# Altium schematic sheet HMC2003_module_SET_RESET.SchDoc
size A2
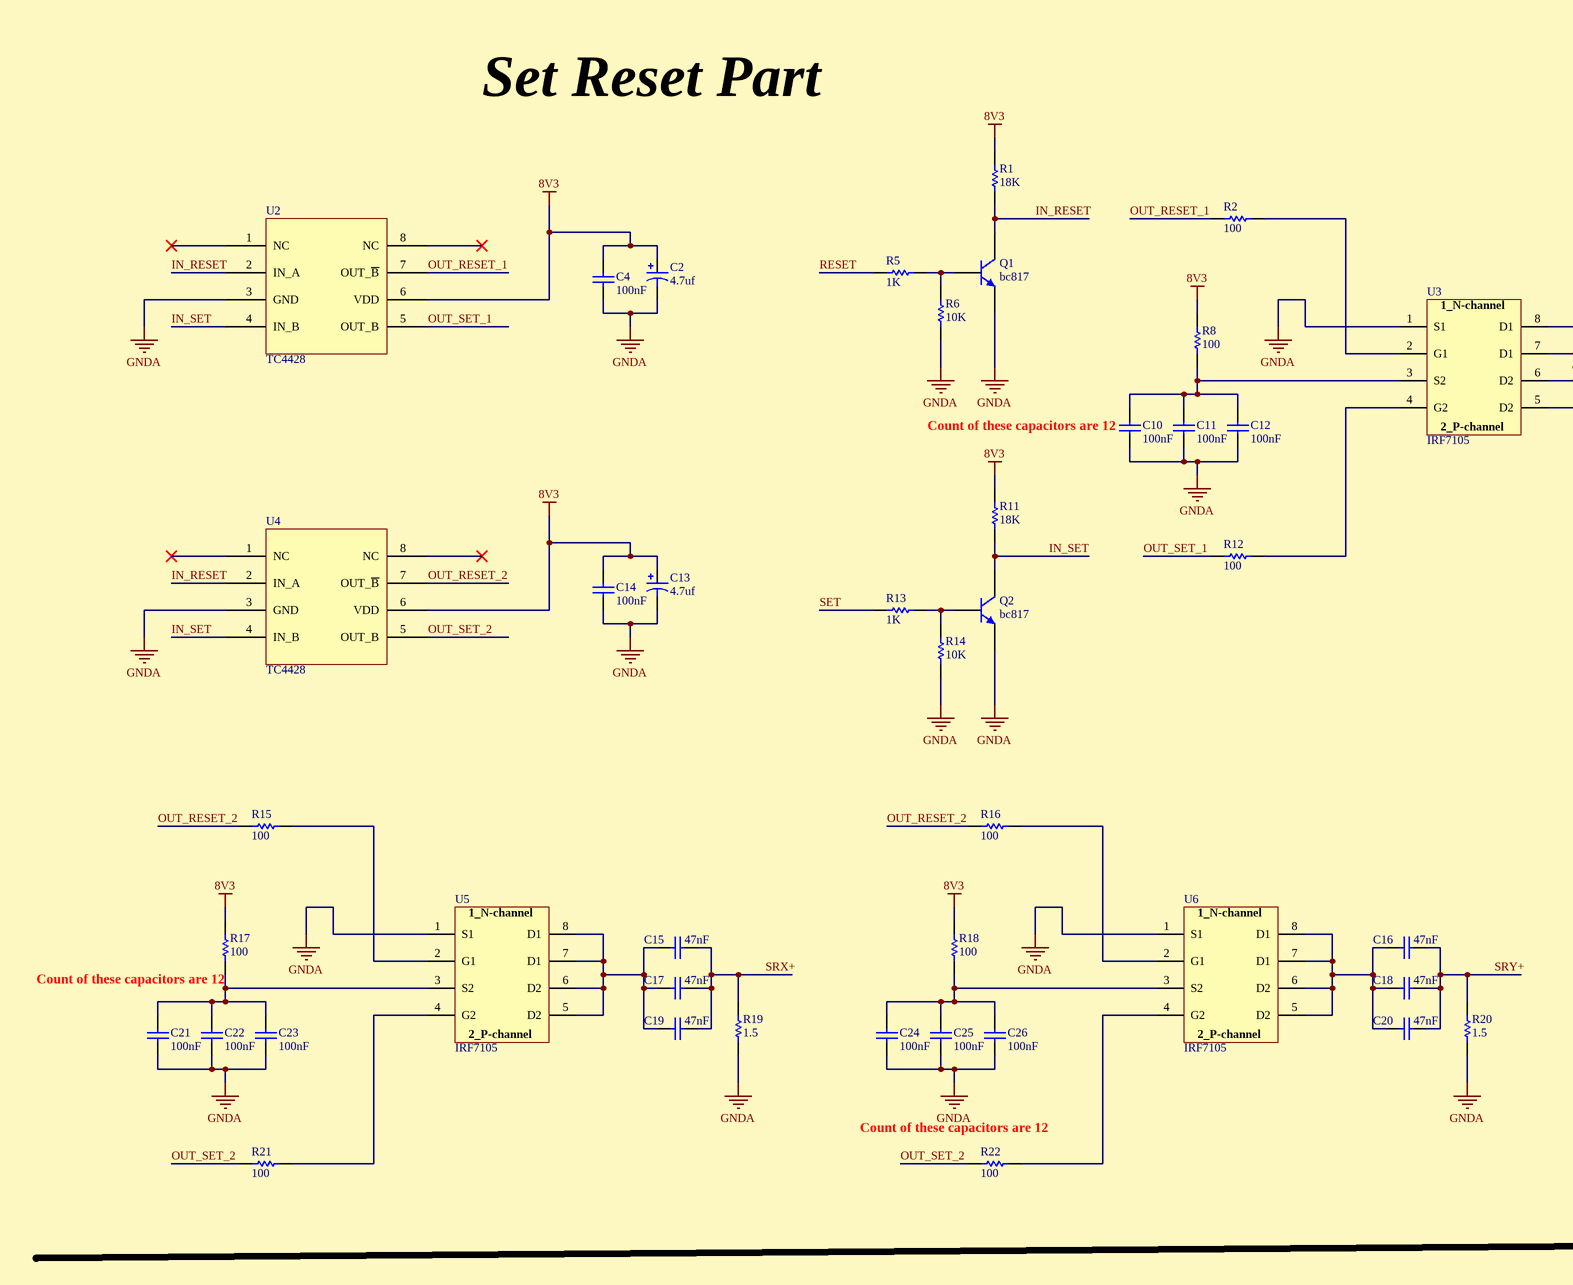
[diagram p0: HMC2003_module_SET_RESET.SchDoc, left]
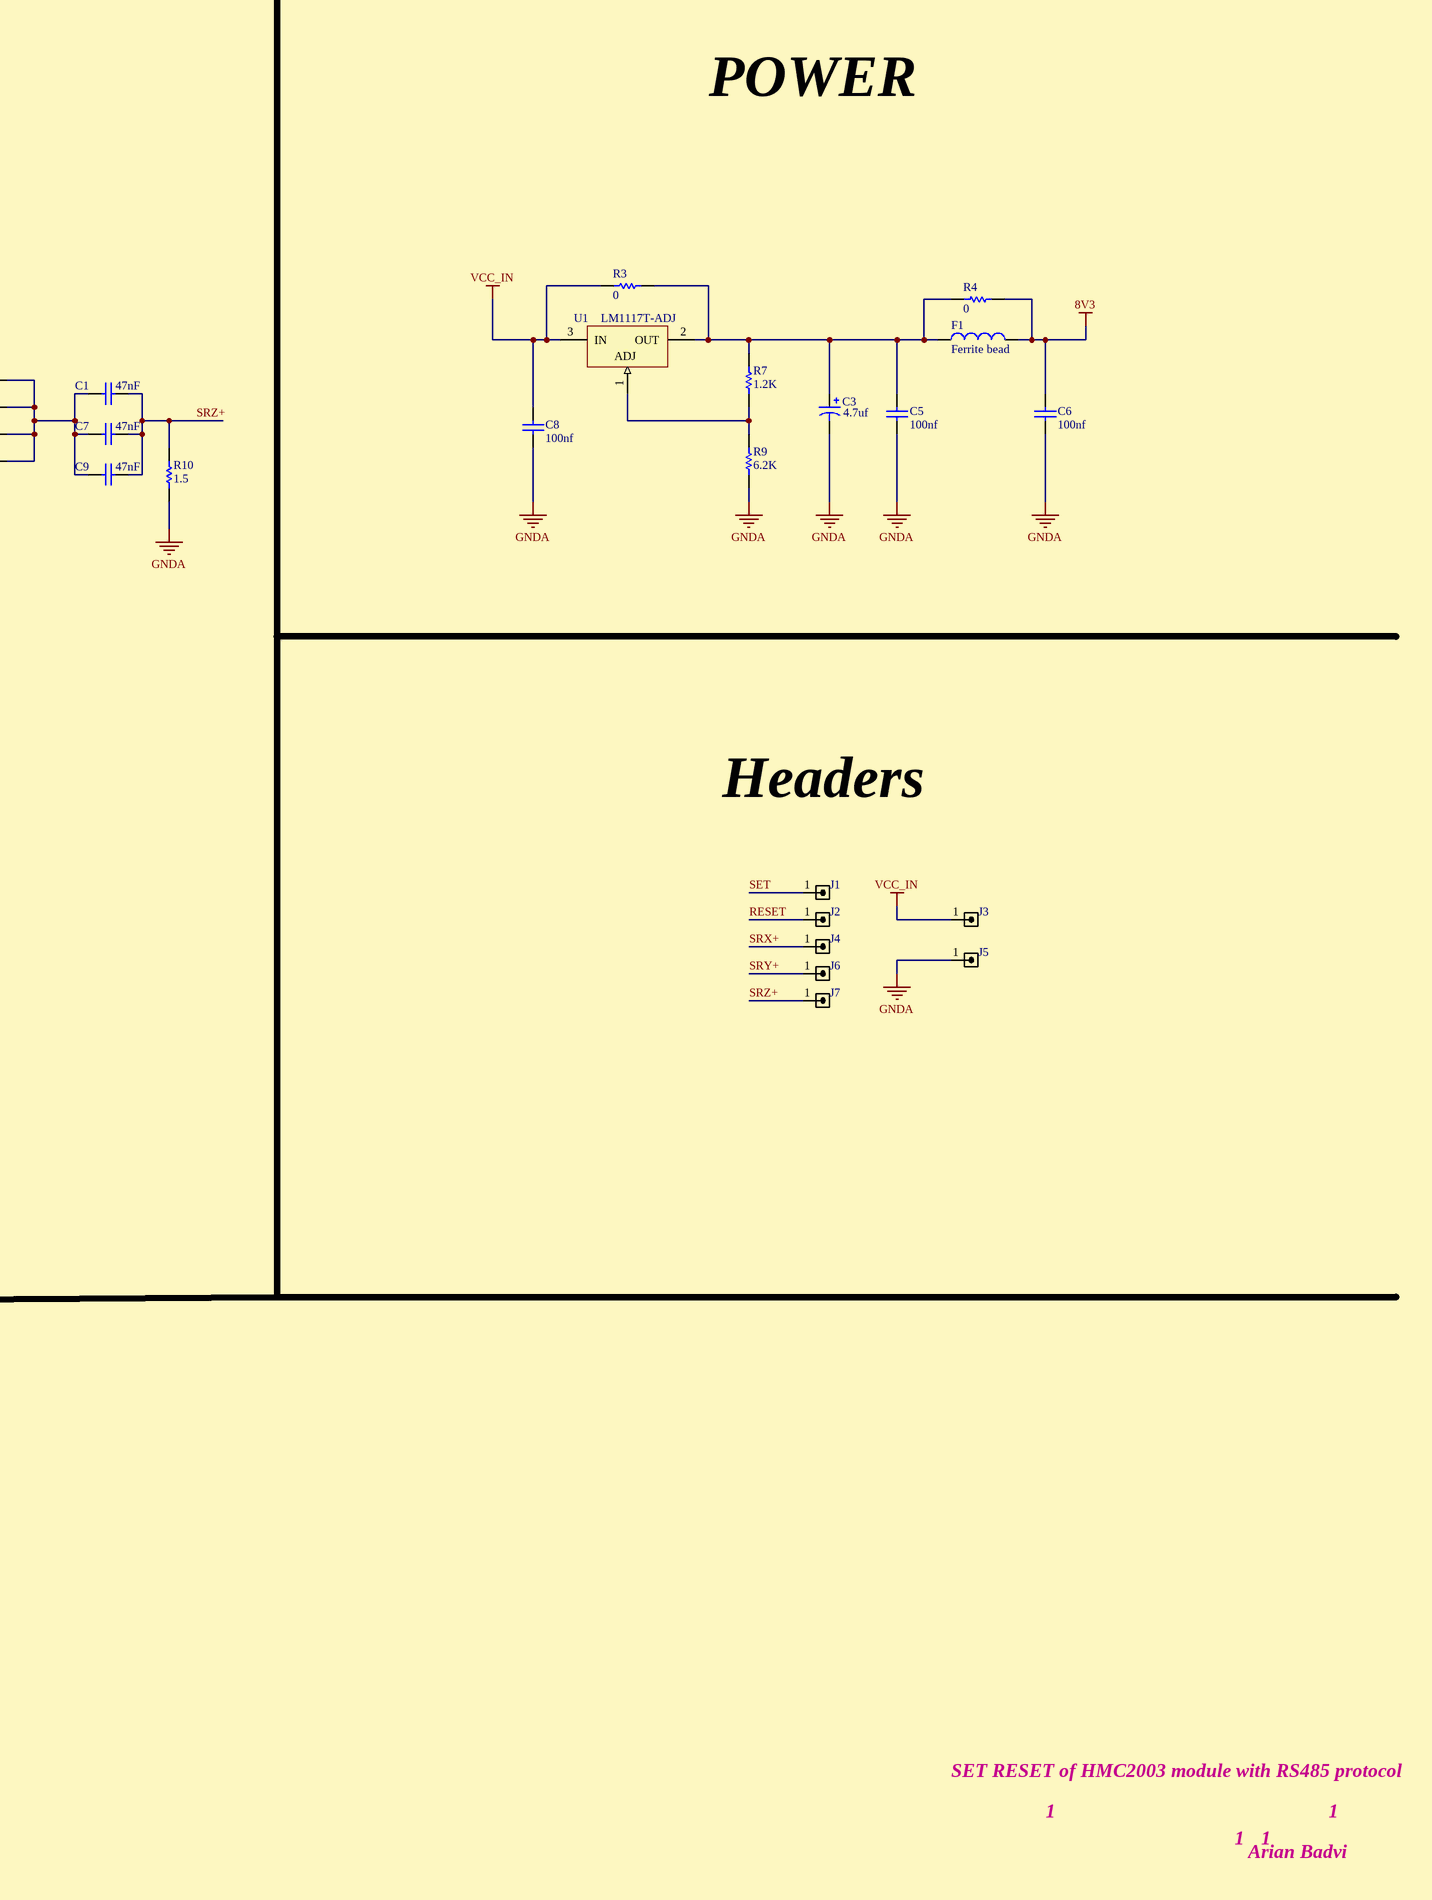
[diagram p1: HMC2003_module_SET_RESET.SchDoc, right]

## Parts
C1  47nF  [C1206]
C2  4.7uf  [cap_smd_a]
C3  4.7uf  [cap_smd_a]
C4  100nF  [C0805]
C5  100nf  [C0805]
C6  100nf  [C0805]
C7  47nF  [C1206]
C8  100nf  [C0805]
C9  47nF  [C1206]
C10  100nF  [C1206]
C11  100nF  [C1206]
C12  100nF  [C1206]
C13  4.7uf  [cap_smd_a]
C14  100nF  [C0805]
C15  47nF  [C1206]
C16  47nF  [C1206]
C17  47nF  [C1206]
C18  47nF  [C1206]
C19  47nF  [C1206]
C20  47nF  [C1206]
C21  100nF  [C1206]
C22  100nF  [C1206]
C23  100nF  [C1206]
C24  100nF  [C1206]
C25  100nF  [C1206]
C26  100nF  [C1206]
F1  Ferrite bead  [0805]
J1  HDRM1  [HDR_M_1]  (value not drawn)
J2  HDRM1  [HDR_M_1]  (value not drawn)
J3  HDRM1  [HDR_M_1]  (value not drawn)
J4  HDRM1  [HDR_M_1]  (value not drawn)
J5  HDRM1  [HDR_M_1]  (value not drawn)
J6  HDRM1  [HDR_M_1]  (value not drawn)
J7  HDRM1  [HDR_M_1]  (value not drawn)
Q1  bc817  [sot-23]
Q2  bc817  [sot-23]
R1  18K  [0805]
R2  100  [0805]
R3  0  [0603]
R4  0  [0603]
R5  1K  [0805]
R6  10K  [0805]
R7  1.2K  [0805]
R8  100  [0805]
R9  6.2K  [0805]
R10  1.5  [0805]
R11  18K  [0805]
R12  100  [0805]
R13  1K  [0805]
R14  10K  [0805]
R15  100  [0805]
R16  100  [0805]
R17  100  [0805]
R18  100  [0805]
R19  1.5  [0805]
R20  1.5  [0805]
R21  100  [0805]
R22  100  [0805]
U1  LM1117T-ADJ  [DPAK]
U2  TC4428  [sop8]
U3  IRF7105  [sop8]
U4  TC4428  [sop8]
U5  IRF7105  [sop8]
U6  IRF7105  [sop8]

## Nets
8V3: C2.1 C4.1 C6.2 C13.1 C14.1 F1.2 R1.2 R4.1 R8.1 R11.2 R17.1 R18.1 U2.6(VDD) U4.6(VDD)
GNDA: C2.2 C3.2 C4.2 C5.1 C6.1 C8.1 C10.2 C11.2 C12.2 C13.2 C14.2 C21.2 C22.2 C23.2 C24.2 C25.2 C26.2 J5.1 Q1.2(E) Q2.2(E) R6.1 R9.1 R10.2 R14.1 R19.2 R20.2 U2.3(GND) U3.1(S1) U4.3(GND) U5.1(S1) U6.1(S1)
VCC_IN: C8.2 J3.1 R3.2 U1.3(IN)
IN_RESET: Q1.3(C) R1.1 U2.2(IN_A) U4.2(IN_A)
IN_SET: Q2.3(C) R11.1 U2.4(IN_B) U4.4(IN_B)
OUT_RESET_1: R2.2 U2.7(OUT_~{B})
OUT_RESET_2: R15.2 R16.2 U4.7(OUT_~{B})
OUT_SET_1: R12.2 U2.5(OUT_B)
OUT_SET_2: R21.2 R22.2 U4.5(OUT_B)
RESET: J2.1 R5.1
SET: J1.1 R13.1
SRX+: C15.2 C17.2 C19.2 J4.1 R19.1
SRY+: C16.2 C18.2 C20.2 J6.1 R20.1
SRZ+: C1.2 C7.2 C9.2 J7.1 R10.1
NetC1_1: C1.1 C7.1 C9.1 U3.5(D2) U3.6(D2) U3.7(D1) U3.8(D1)
NetC3_1: C3.1 C5.2 F1.1 R3.1 R4.2 R7.2 U1.2(OUT)
NetC10_1: C10.1 C11.1 C12.1 R8.2 U3.3(S2)
NetC15_1: C15.1 C17.1 C19.1 U5.5(D2) U5.6(D2) U5.7(D1) U5.8(D1)
NetC16_1: C16.1 C18.1 C20.1 U6.5(D2) U6.6(D2) U6.7(D1) U6.8(D1)
NetC21_1: C21.1 C22.1 C23.1 R17.2 U5.3(S2)
NetC24_1: C24.1 C25.1 C26.1 R18.2 U6.3(S2)
NetQ1_1: Q1.1(B) R5.2 R6.2
NetQ2_1: Q2.1(B) R13.2 R14.2
NetR2_1: R2.1 U3.2(G1)
NetR7_1: R7.1 R9.2 U1.1(ADJ)
NetR12_1: R12.1 U3.4(G2)
NetR15_1: R15.1 U5.2(G1)
NetR16_1: R16.1 U6.2(G1)
NetR21_1: R21.1 U5.4(G2)
NetR22_1: R22.1 U6.4(G2)

Not connected (* = marked no-connect by the designer): U2 1(NC)* 8(NC)*; U4 1(NC)* 8(NC)*

## Notes on the sheet
- POWER
- Set Reset Part
- (near C10) Count of these capacitors are 12
- Headers
- (near R17) Count of these capacitors are 12
- (near R22) Count of these capacitors are 12
- SET RESET of HMC2003 module with RS485 protocol
- 1
- Arian Badvi
- (in symbol IRF7106) 1_N-channel; 2_P-channel

## Library data of the parts
C1 C4-C12 C14-C26 = Cap: Capacitor; Published: 8-Jun-2000; LatestRevisionDate: 17-Jul-2002; LatestRevisionNote: Re-released for DXP Platform.; PackageReference: RAD-0.3; Publisher: Altium Limited; PackageDescription: Radial Cap, Thru-Hole; 2 Leads; 0.3 in Pin Spacing
  C1 C7 C9 C15-C20: Value: 47nF
  C4 C10-C12 C14 C21-C26: Value: 100nF
  C5 C6 C8: Value: 100nf
C2 C3 C13 = Cap Pol1: Polarized Capacitor (Radial); Published: 8-Jun-2000; LatestRevisionDate: 17-Jul-2002; LatestRevisionNote: Re-released for DXP Platform.; PackageReference: RB7.6-15; Publisher: Altium Limited; PackageDescription: Polarized Capacitor (Radial); 2 Leads; Value: 4.7uf
F1 = Inductor: Ferrite bead, 1206; Code_IEC: 1005; Value: 10mH; Published: 8-Jun-2000; LatestRevisionDate: 29-May-2009; LatestRevisionNote: IPC-7351 Footprint Added.; PackageReference: 0402-A; Publisher: Altium Limited; PackageDescription: Chip Inductor; Code_JEITA: 0402
J1-J7 = HDR_M_1: CONN, HEADER, Male, pitch: 2.54mm, 1POS; VALUE: HDRM1
Q1 Q2 = 2N3904: NPN General Purpose Amplifier; Published: 8-Jun-2000; LatestRevisionDate: 15-Jan-2003; LatestRevisionNote: PCB Footprint 'BCY-W3/D4.7' replaced; DatasheetVersion: 1997; PackageVersion: Sep-1998; PackageReference: TO-92A; Publisher: Altium Limited; PackageDescription: TO, Flat Index; 3 In-Line, Axial Leads; Body Dia. 4.5mm; Leads 0.51 x 0.48 mm (max); ComponentLink1Description: Manufacturer Link; ComponentLink1URL: http://www.fairchildsemi.com/; ComponentLink2Description: Datasheet; ComponentLink2URL: http://www.fairchildsemi.com/ds/2N%2F2N3904.pdf
R1 R2 R5 R6 R8 R10-R22 = Res1: Resistor; Published: 8-Jun-2000; LatestRevisionDate: 17-Jul-2002; LatestRevisionNote: Re-released for DXP Platform.; PackageReference: AXIAL-0.3; Publisher: Altium Limited; PackageDescription: Axial Device, Thru-Hole; 2 Leads; 0.3 in Pin Spacing
  R1 R11: Value: 18K
  R2 R8 R12 R15-R18 R21 R22: Value: 100
  R5 R13: Value: 1K
  R6 R14: Value: 10K
  R10 R19 R20: Value: 1.5
R3 R4 R7 R9 = Resistor: Email: razi.vesali@gmail.com; Published: 17-Jun-2016; LatestRevisionNote: Re-released for puplic; Publisher: Seyed Razi Vesali
  R3 R4: Value: 0
  R7: Value: 1.2K
  R9: Value: 6.2K
U1 = LM1117T-ADJ: 800mA Low-Dropout Linear Regulator; Manufacturer: National Semiconductor; CompType: LDO IC; PackageTopMarking: NSUZXYTTE#*LM1117T*ADJ; PowerWise: N; Published: 4-Dec-2008; DatasheetVersion: Apr-2006; PackageVersion: revL, Jan-1992; PackageReference: T03B; Publisher: Altium Limited; PackageDescription: TO-220, Molded, 3 Lead, Straight; PartNumber: LM1117T-ADJ; RoHS: O; PinCount: 3; DigiKeyPartNumber: LM1117T-ADJ-ND; ComponentLink1Description: LM1117 Datasheet; ComponentLink1URL: http://www.national.com/ds/LM/LM1117.pdf; ComponentLink2Description: LM1117 Web Page; ComponentLink2URL: http://www.national.com/pf/LM/LM1117.html; ComponentLink3Description: T03B Package Page; ComponentLink3URL: http://www.national.com/packaging/folders/t03b.html
U3 U5 U6 = IRF7106